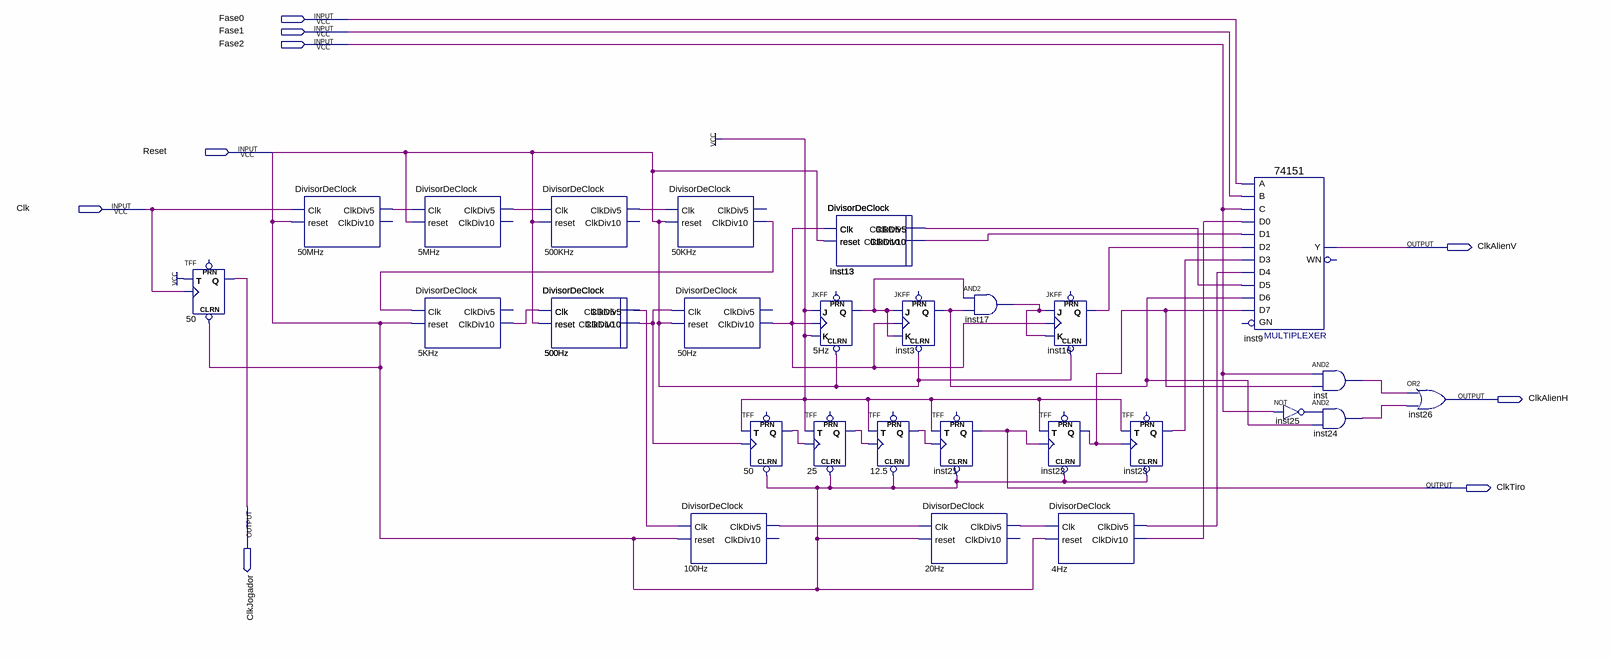
[diagram p0: schematic sheet]
// Quartus schematic GeradorDeClocks.bdf as structural Verilog: 32 symbols, 9 pins
module GeradorDeClocks (
  input  Fase0,
  input  Fase1,
  input  Fase2,
  input  Reset,
  input  Clk,
  output ClkAlienV,
  output ClkAlienH,
  output ClkTiro,
  output ClkJogador
);

  wire inst3_q, inst13_clkdiv5, inst13_clkdiv10, inst16_q, inst17_out, inst22_q, inst23_q, inst24_out,
       inst25_out, inst_out, n4Hz_clkdiv5, n4Hz_clkdiv10, n5Hz_q, n5KHz_clkdiv10, n5MHz_clkdiv5, n12_5_q,
       n20Hz_clkdiv5, n25_q, n50_q, n50Hz_clkdiv10, n50KHz_clkdiv10, n50MHz_clkdiv5, n100Hz_clkdiv5,
       n500Hz_clkdiv5, n500Hz_clkdiv10, n500KHz_clkdiv5;

  TFF u_50 (.CLRN(Reset), .T(1'b1), .CLK(Clk), .Q(ClkJogador));  // open: PRN
  DivisorDeClock u_50MHz (.Clk(Clk), .reset(Reset), .ClkDiv5(n50MHz_clkdiv5));  // open: ClkDiv10
  DivisorDeClock u_5MHz (.Clk(n50MHz_clkdiv5), .reset(Reset), .ClkDiv5(n5MHz_clkdiv5));  // open: ClkDiv10
  DivisorDeClock u_5KHz (.Clk(n50KHz_clkdiv10), .reset(Reset), .ClkDiv10(n5KHz_clkdiv10));  // open: ClkDiv5
  DivisorDeClock u_500KHz (.Clk(n5MHz_clkdiv5), .reset(Reset), .ClkDiv5(n500KHz_clkdiv5));  // open: ClkDiv10
  DivisorDeClock u_500Hz (.Clk(n5KHz_clkdiv10), .ClkDiv5(n500Hz_clkdiv5));  // open: ClkDiv10
  DivisorDeClock u_500Hz_dup2 (
    .Clk(n5KHz_clkdiv10), .reset(Reset), .ClkDiv5(n500Hz_clkdiv5), .ClkDiv10(n500Hz_clkdiv10));
  DivisorDeClock u_500Hz_dup3 (
    .Clk(n5KHz_clkdiv10), .reset(Reset), .ClkDiv5(n500Hz_clkdiv5), .ClkDiv10(n500Hz_clkdiv10));
  DivisorDeClock u_50KHz (.Clk(n500KHz_clkdiv5), .reset(Reset), .ClkDiv10(n50KHz_clkdiv10));  // open: ClkDiv5
  DivisorDeClock u_50Hz (.Clk(n500Hz_clkdiv10), .reset(Reset), .ClkDiv10(n50Hz_clkdiv10));  // open: ClkDiv5
  DivisorDeClock u_100Hz (.Clk(n500Hz_clkdiv5), .reset(Reset), .ClkDiv5(n100Hz_clkdiv5));  // open: ClkDiv10
  TFF u_50_dup2 (.CLRN(Reset), .T(1'b1), .CLK(n500Hz_clkdiv10), .Q(n50_q));  // open: PRN
  DivisorDeClock inst13 (.Clk(n50Hz_clkdiv10));  // open: ClkDiv5, ClkDiv10
  DivisorDeClock inst13_dup2 (
    .Clk(n50Hz_clkdiv10), .reset(Reset), .ClkDiv5(inst13_clkdiv5), .ClkDiv10(inst13_clkdiv10));
  DivisorDeClock inst13_dup3 (
    .Clk(n50Hz_clkdiv10), .reset(Reset), .ClkDiv5(inst13_clkdiv5), .ClkDiv10(inst13_clkdiv10));
  DivisorDeClock inst13_dup4 (
    .Clk(n50Hz_clkdiv10), .reset(Reset), .ClkDiv5(inst13_clkdiv5), .ClkDiv10(inst13_clkdiv10));
  JKFF u_5Hz (.CLRN(Reset), .K(1'b1), .J(1'b1), .CLK(n50Hz_clkdiv10), .Q(n5Hz_q));  // open: PRN
  TFF u_25 (.CLRN(Reset), .T(1'b1), .CLK(n50_q), .Q(n25_q));  // open: PRN
  JKFF inst3 (.CLRN(Reset), .K(n5Hz_q), .J(n5Hz_q), .CLK(n50Hz_clkdiv10), .Q(inst3_q));  // open: PRN
  TFF \u_12.5  (.CLRN(Reset), .T(1'b1), .CLK(n25_q), .Q(n12_5_q));  // open: PRN
  TFF inst21 (.CLRN(Reset), .T(1'b1), .CLK(n12_5_q), .Q(ClkTiro));  // open: PRN
  DivisorDeClock u_20Hz (.Clk(n100Hz_clkdiv5), .reset(Reset), .ClkDiv5(n20Hz_clkdiv5));  // open: ClkDiv10
  and inst17 (inst17_out, n5Hz_q, inst3_q);
  JKFF inst16 (.CLRN(Reset), .K(inst17_out), .J(inst17_out), .CLK(n50Hz_clkdiv10), .Q(inst16_q));  // open: PRN
  TFF inst22 (.CLRN(Reset), .T(1'b1), .CLK(ClkTiro), .Q(inst22_q));  // open: PRN
  DivisorDeClock u_4Hz (.Clk(n20Hz_clkdiv5), .reset(Reset), .ClkDiv5(n4Hz_clkdiv5), .ClkDiv10(n4Hz_clkdiv10));
  TFF inst23 (.CLRN(Reset), .T(1'b1), .CLK(inst22_q), .Q(inst23_q));  // open: PRN
  \74151  inst9 (
    .C(Fase2), .B(Fase1), .A(Fase0), .D5(inst13_clkdiv5), .D0(n4Hz_clkdiv10), .D1(inst13_clkdiv10),
    .D4(n4Hz_clkdiv5), .D3(inst23_q), .D2(inst16_q), .D6(inst3_q), .D7(inst22_q), .Y(ClkAlienV));  // open: GN, WN
  not inst25 (inst25_out, Fase2);
  and inst (inst_out, Fase2, inst22_q);
  and inst24 (inst24_out, inst25_out, inst3_q);
  or inst26 (ClkAlienH, inst_out, inst24_out);
endmodule
